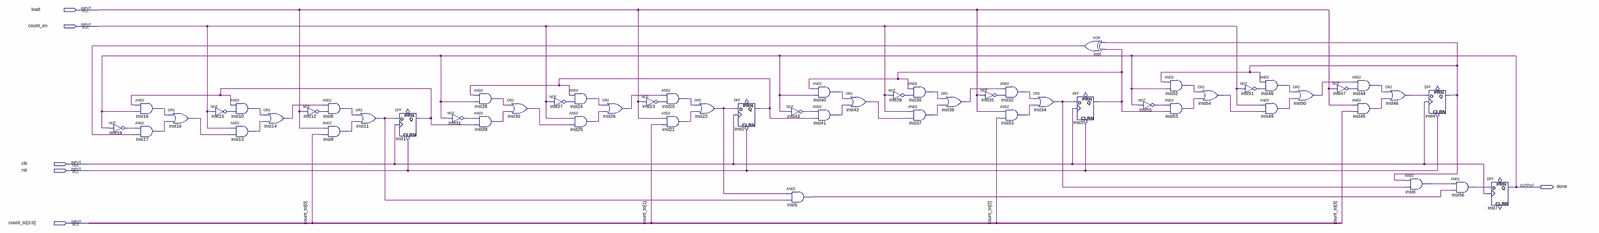
[diagram p0: schematic sheet, whole]
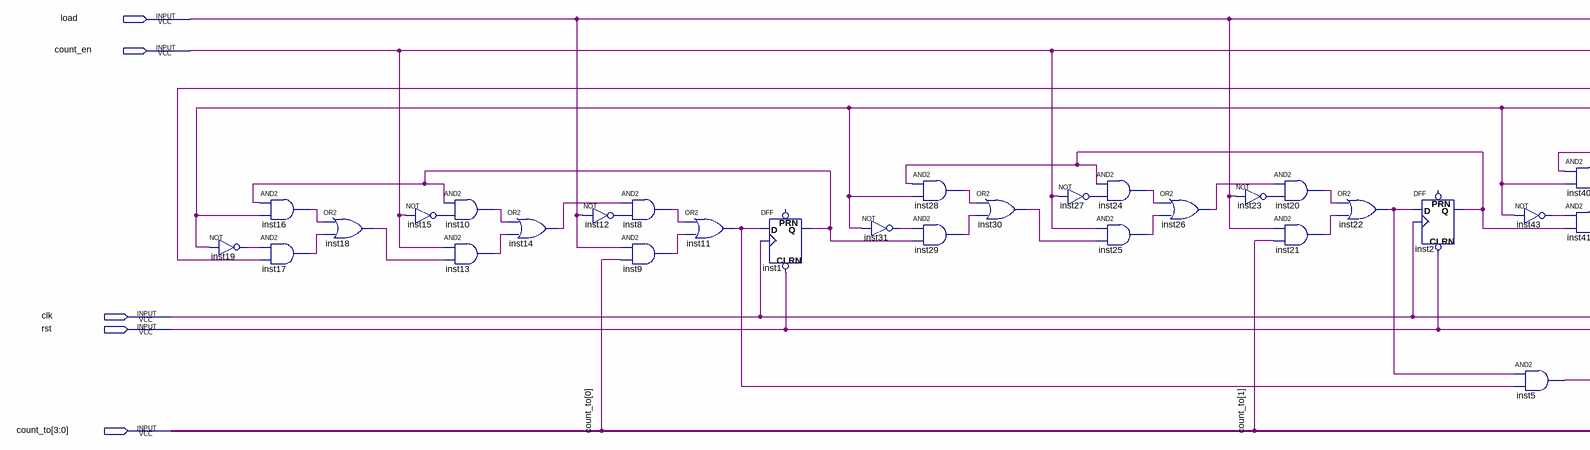
[diagram p1: schematic sheet, left part]
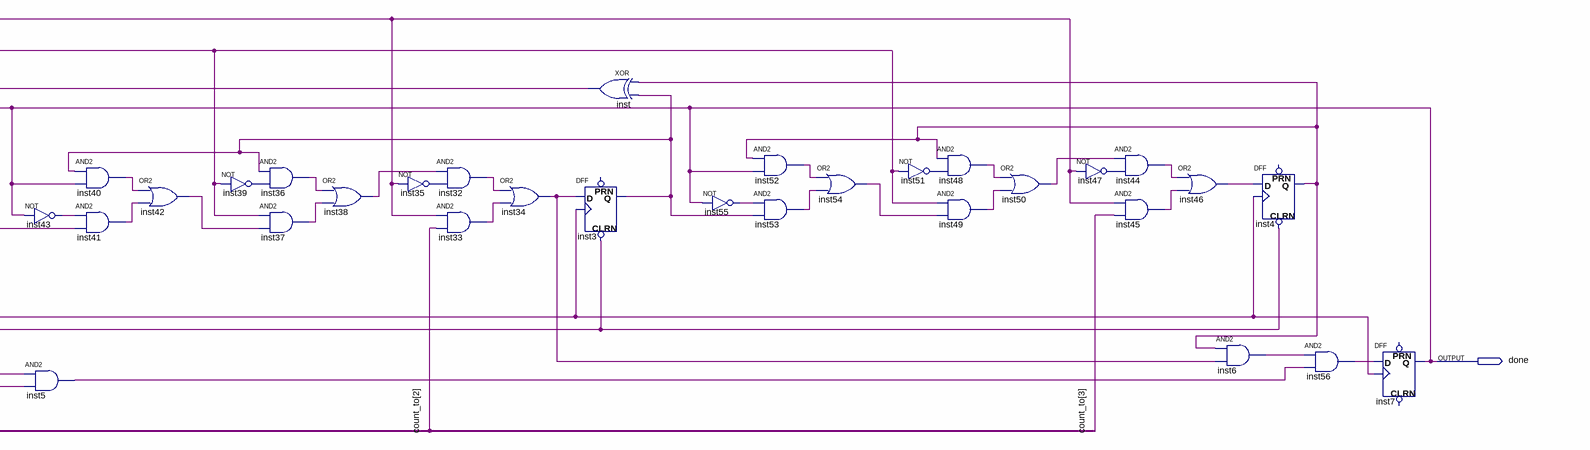
[diagram p2: schematic sheet, right part]
// Quartus schematic LFSR_4bit_sch.bdf as structural Verilog: 57 symbols, 6 pins
module LFSR_4bit_sch (
  input  load,
  input  count_en,
  input  clk,
  input  rst,
  input  [3:0] count_to,
  output done
);

  wire inst1_q, inst2_q, inst3_q, inst4_q, inst5_out, inst6_out, inst8_out, inst9_out, inst10_out,
       inst11_out, inst12_out, inst13_out, inst14_out, inst15_out, inst16_out, inst17_out, inst18_out,
       inst19_out, inst20_out, inst21_out, inst22_out, inst23_out, inst24_out, inst25_out, inst26_out,
       inst27_out, inst28_out, inst29_out, inst30_out, inst31_out, inst32_out, inst33_out, inst34_out,
       inst35_out, inst36_out, inst37_out, inst38_out, inst39_out, inst40_out, inst41_out, inst42_out,
       inst43_out, inst44_out, inst45_out, inst46_out, inst47_out, inst48_out, inst49_out, inst50_out,
       inst51_out, inst52_out, inst53_out, inst54_out, inst55_out, inst56_out, inst_out;

  not inst19 (inst19_out, done);
  and inst16 (inst16_out, inst1_q, done);
  and inst17 (inst17_out, inst19_out, inst_out);
  or inst18 (inst18_out, inst16_out, inst17_out);
  and inst10 (inst10_out, inst1_q, inst15_out);
  not inst15 (inst15_out, count_en);
  and inst13 (inst13_out, count_en, inst18_out);
  or inst14 (inst14_out, inst10_out, inst13_out);
  not inst12 (inst12_out, load);
  and inst8 (inst8_out, inst14_out, inst12_out);
  and inst9 (inst9_out, load, count_to[0]);
  or inst11 (inst11_out, inst8_out, inst9_out);
  DFF inst1 (.CLRN(rst), .CLK(clk), .D(inst11_out), .Q(inst1_q));  // open: PRN
  not inst31 (inst31_out, done);
  and inst28 (inst28_out, inst2_q, done);
  and inst29 (inst29_out, inst31_out, inst1_q);
  or inst30 (inst30_out, inst28_out, inst29_out);
  not inst27 (inst27_out, count_en);
  and inst24 (inst24_out, inst2_q, inst27_out);
  and inst25 (inst25_out, count_en, inst30_out);
  or inst26 (inst26_out, inst24_out, inst25_out);
  not inst23 (inst23_out, load);
  and inst20 (inst20_out, inst26_out, inst23_out);
  and inst21 (inst21_out, load, count_to[1]);
  or inst22 (inst22_out, inst20_out, inst21_out);
  DFF inst2 (.CLRN(rst), .CLK(clk), .D(inst22_out), .Q(inst2_q));  // open: PRN
  not inst43 (inst43_out, done);
  and inst5 (inst5_out, inst22_out, inst11_out);
  and inst40 (inst40_out, inst3_q, done);
  and inst41 (inst41_out, inst43_out, inst2_q);
  or inst42 (inst42_out, inst40_out, inst41_out);
  not inst39 (inst39_out, count_en);
  and inst36 (inst36_out, inst3_q, inst39_out);
  and inst37 (inst37_out, count_en, inst42_out);
  or inst38 (inst38_out, inst36_out, inst37_out);
  not inst35 (inst35_out, load);
  and inst32 (inst32_out, inst38_out, inst35_out);
  and inst33 (inst33_out, load, count_to[2]);
  or inst34 (inst34_out, inst32_out, inst33_out);
  DFF inst3 (.CLRN(rst), .CLK(clk), .D(inst34_out), .Q(inst3_q));  // open: PRN
  xor inst (inst_out, inst4_q, inst3_q);
  not inst55 (inst55_out, done);
  and inst52 (inst52_out, inst4_q, done);
  and inst53 (inst53_out, inst55_out, inst3_q);
  or inst54 (inst54_out, inst52_out, inst53_out);
  and inst48 (inst48_out, inst4_q, inst51_out);
  not inst51 (inst51_out, count_en);
  and inst49 (inst49_out, count_en, inst54_out);
  or inst50 (inst50_out, inst48_out, inst49_out);
  not inst47 (inst47_out, load);
  and inst44 (inst44_out, inst50_out, inst47_out);
  and inst45 (inst45_out, load, count_to[3]);
  or inst46 (inst46_out, inst44_out, inst45_out);
  and inst6 (inst6_out, inst4_q, inst34_out);
  DFF inst4 (.CLRN(rst), .CLK(clk), .D(inst46_out), .Q(inst4_q));  // open: PRN
  and inst56 (inst56_out, inst6_out, inst5_out);
  DFF inst7 (.CLK(clk), .D(inst56_out), .Q(done));  // open: CLRN, PRN
endmodule
